# EAGLE schematic USB_Tester_3_schematic (EAGLE 6.5.0)
TITLE: USB TESTER
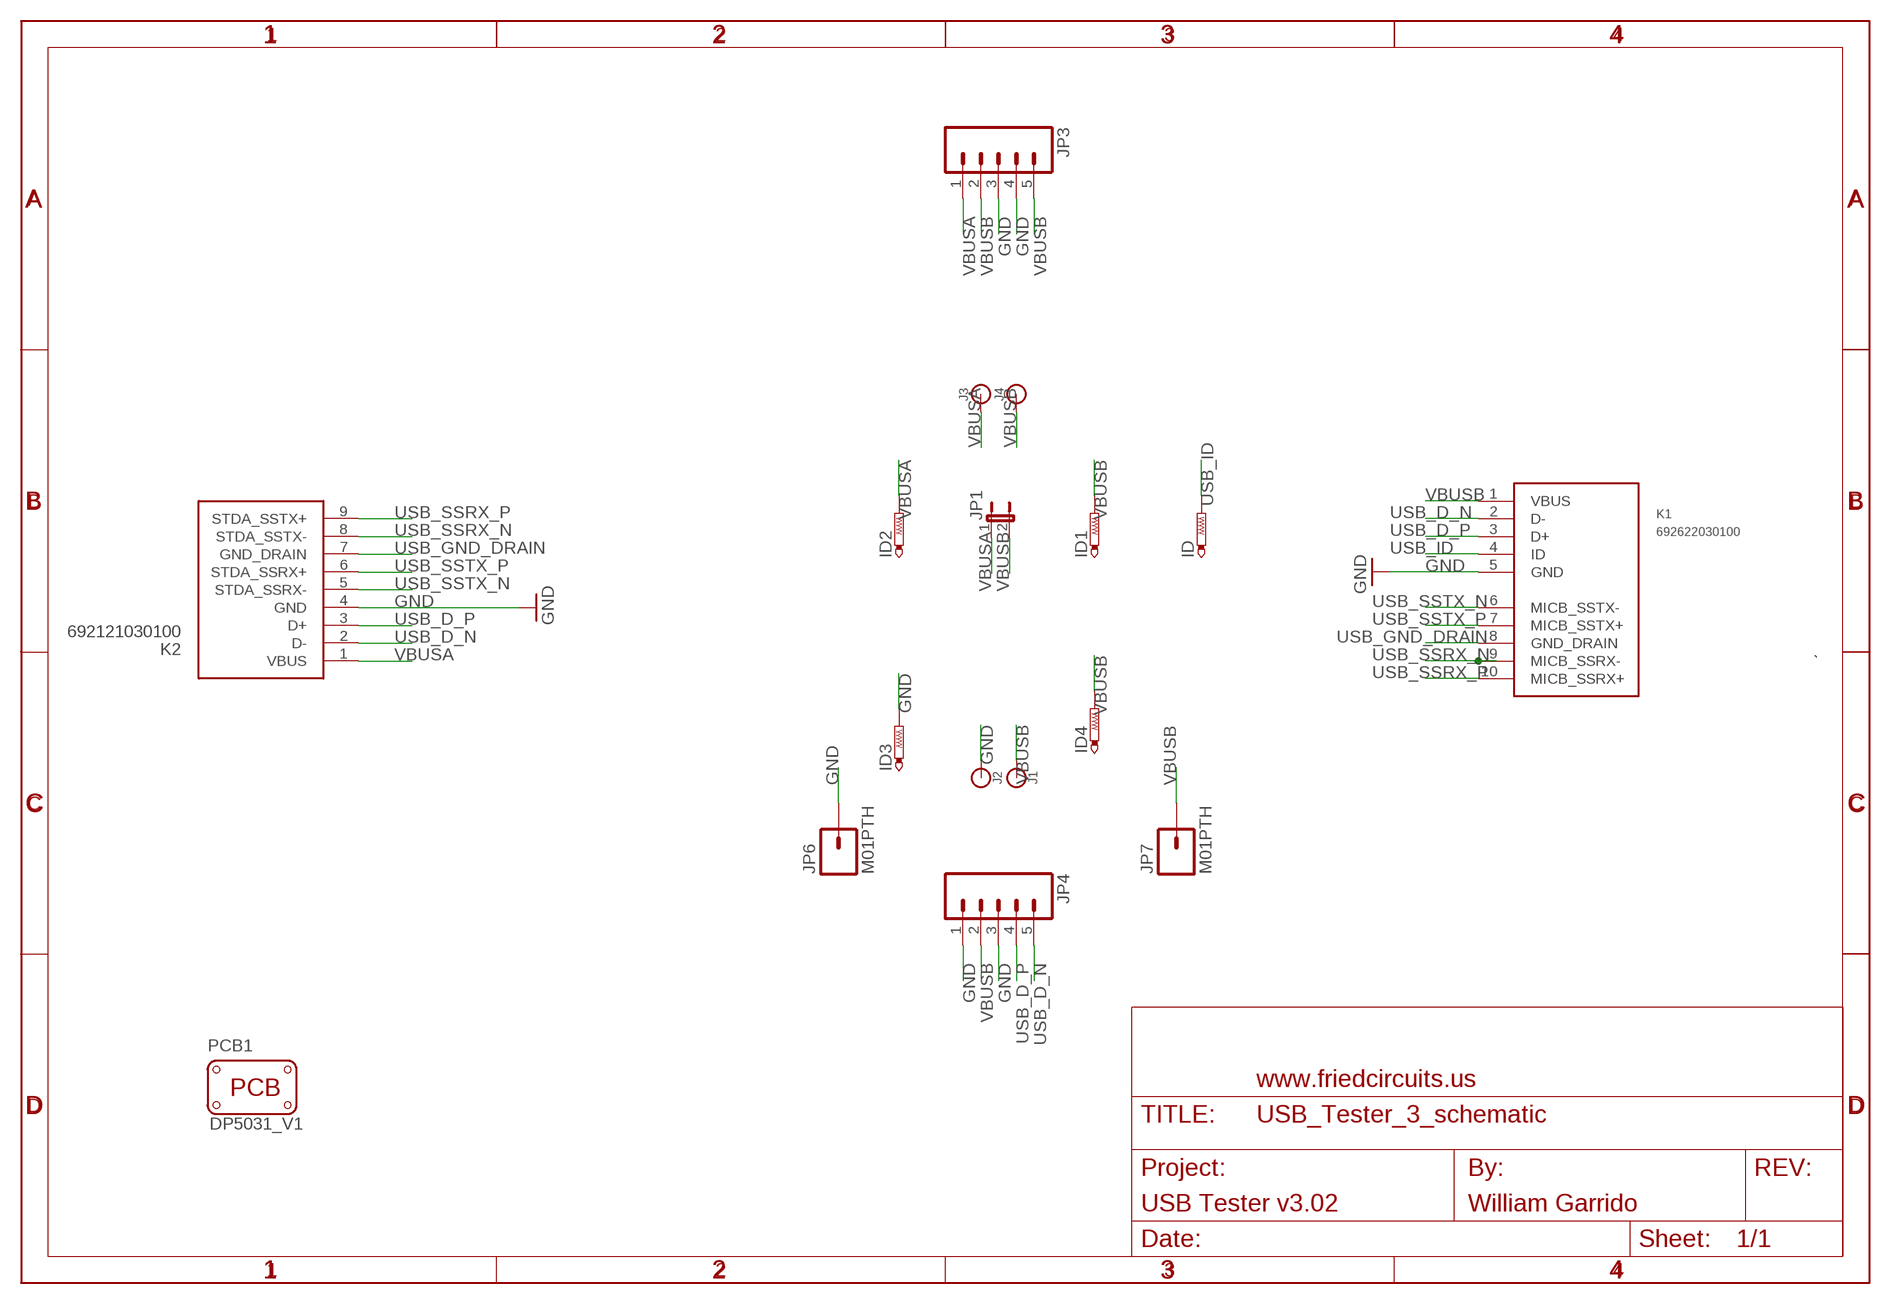
[diagram p0: schematic, sheet 1]

## Parts
ID  PTR1PAD1-20  [P1-20]
ID1  PTR1PAD1-20  [P1-20]
ID2  PTR1PAD1-20  [P1-20]
ID3  PTR1PAD1-20  [P1-20]
ID4  PTR1PAD1-20  [P1-20]
J1  BANANA_CONN  [BANANA_CONN]
J2  BANANA_CONN  [BANANA_CONN]
J3  BANANA_CONN  [BANANA_CONN]
J4  BANANA_CONN  [BANANA_CONN]
JP1  JUMPER-2PTH_LOCK  [1X02_LOCK]
JP3  M05LOCK  [1X05_LOCK]
JP4  M05LOCK  [1X05_LOCK]
JP6  M01PTH  [1X01]
JP7  M01PTH  [1X01]
K1  692622030100  [692622030100]
K2  692121030100  [692121030100]
PCB1  PCB_DP_RECTANGLE-31X50  [DP5031_V1]
U$1  FRAME_DINA4_L  [FC_CREDIT]

## Nets
GND: ID3.TP J2.P$1 JP3.3 JP3.4 JP4.1 JP4.3 JP6.1 K1.5(GND) K2.4(GND)
USB_D_N [USB_DIFF]: JP4.5 K1.2(D-) K2.2(D-)
USB_D_P [USB_DIFF]: JP4.4 K1.3(D+) K2.3(D+)
USB_GND_DRAIN: K1.8(GND_DRAIN) K2.7(GND_DRAIN)
USB_ID: ID.TP K1.4(ID)
USB_SSRX_N [USB_DIFF]: K1.9(MICB_SSRX-) K2.8(STDA_SSTX-)
USB_SSRX_P [USB_DIFF]: K1.10(MICB_SSRX+) K2.9(STDA_SSTX+)
USB_SSTX_N [USB_DIFF]: K1.6(MICB_SSTX-) K2.5(STDA_SSRX-)
USB_SSTX_P [USB_DIFF]: K1.7(MICB_SSTX+) K2.6(STDA_SSRX+)
VBUSA [VBUS]: ID2.TP J3.P$1 JP1.1 JP3.1 K2.1(VBUS)
VBUSB [VBUS]: ID1.TP ID4.TP J1.P$1 J4.P$1 JP1.2 JP3.2 JP3.5 JP4.2 JP7.1 K1.1(VBUS)

## Library data of the parts
ID ID1-ID4 = testpad:PTR1: TEST PIN
J1-J4 = SparkFun-Connectors:BANANA_CONN: Through-hole banana jack
JP1 = SparkFun-Passives:JUMPER-2: Jumper Basic 0.1" spaced jumper. Use with breakaway headers.
JP3 JP4 = SparkFun-Connectors:M05: Header 5 Standard 5-pin 0.1" header. Use with straight break away headers (SKU : PRT-00116), right angle break away headers (PRT-00553), swiss pins (PRT-00743), machine pins (PRT-00117), and female headers (PRT-00115). Molex polarized connector foot print use with SKU : PRT-08230 with associated crimp pins and housings.
JP6 JP7 = SparkFun-Connectors:M01: Header 1 Standard 1-pin 0.1" header. Use with straight break away headers (SKU : PRT-00116), right angle break away headers (PRT-00553), swiss pins (PRT-00743), machine pins (PRT-00117), and female headers (PRT-00115).
K1 = Wuerth_Elektronik_eiCan_Communication_Connectors_v2.2:692622030100: WR-COMMICRO USB 3.0 HORIZONTAL SMT TYPE B
K2 = Wuerth_Elektronik_eiCan_Communication_Connectors_v2.2:692121030100: WR-COM USB 3.0 HORIZONTAL TYPE A
PCB1 = dp_devices:PCB_DP_RECTANGLE: Dangerous Prototypes Standard Rectangular PCB sizes; PCB_SIZE: DP5031_V1
U$1 = FriedCircuits:FRAME_DINA4_L: A4 FC frame Standard FriedCircuits schematic frame. Automagically adds the standard texts to the PCB Use the atrribute in the schematic editor to change the fields.; AUTHOR: William Garrido; FF1: fulfillment by; FF2: FriedCircuits; FF3: friedcircuits.us; PROJECT: USB Tester v3.02; URL2: www.friedcircuits.us

## Net classes
0 default: width 0.203 mm, drill 0.33 mm
1 VBUS: width 0.61 mm, drill 0.33 mm
2 ID: width 0.254 mm, drill 0.33 mm
3 USB_DIFF: width 0.203 mm, drill 0.33 mm, clearance 0.2 mm